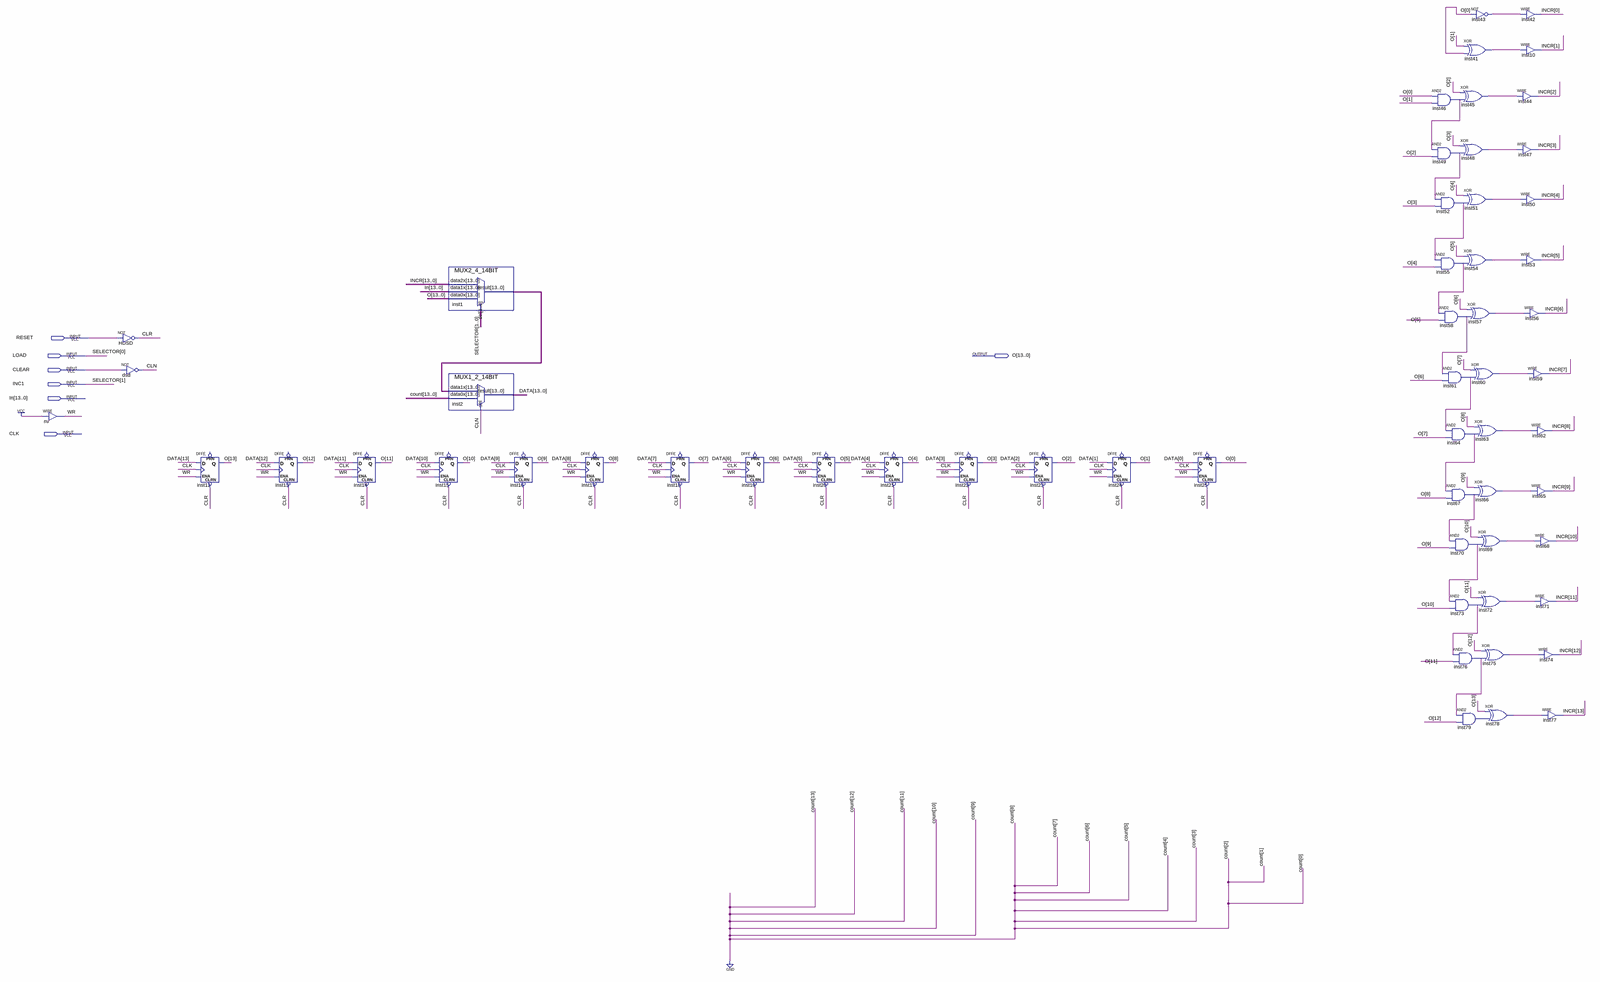
[diagram p0: schematic sheet, whole]
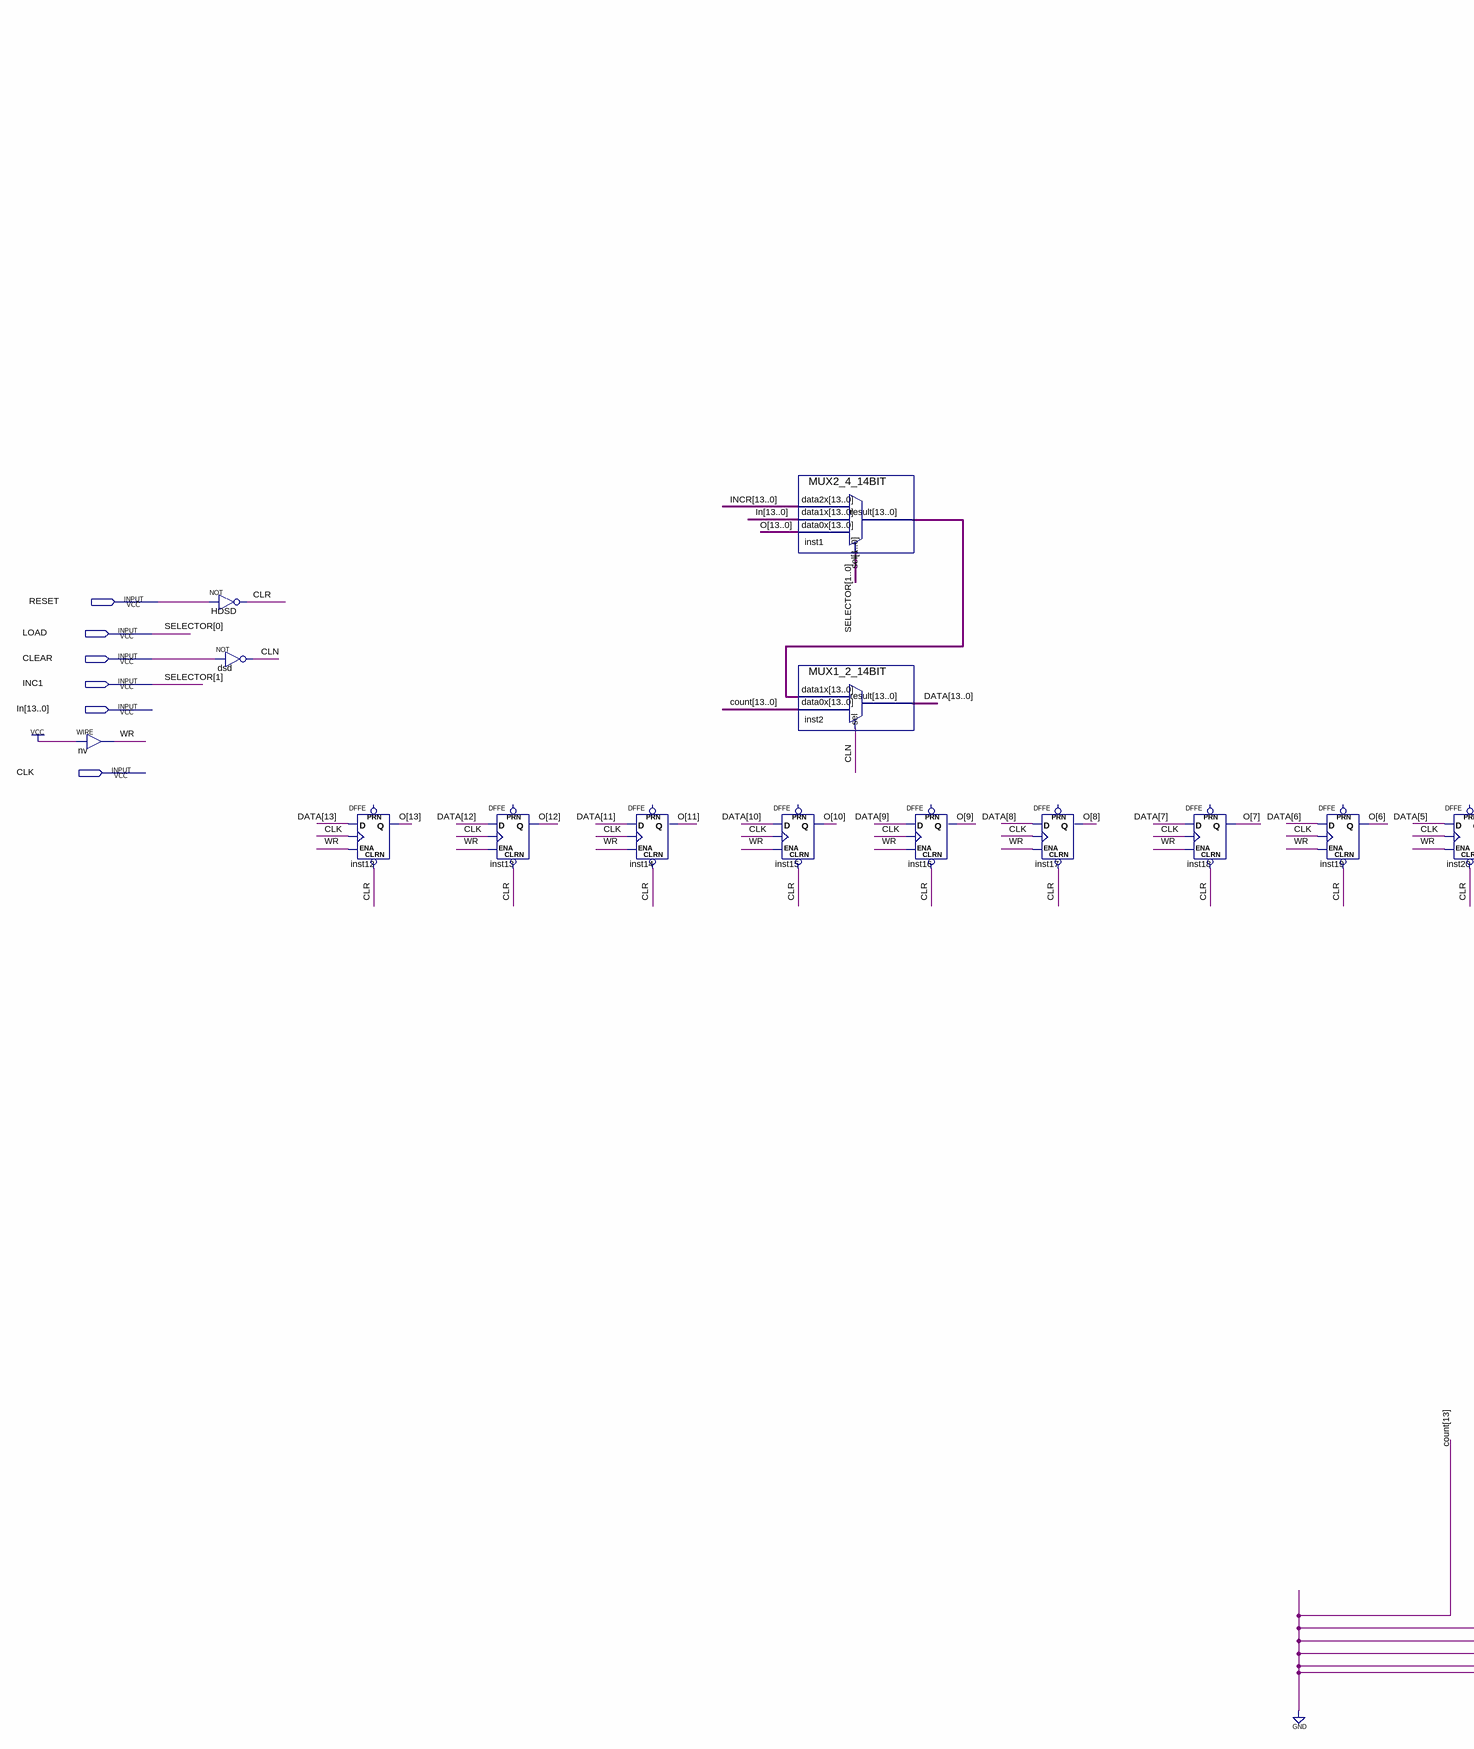
[diagram p1: schematic sheet, left part]
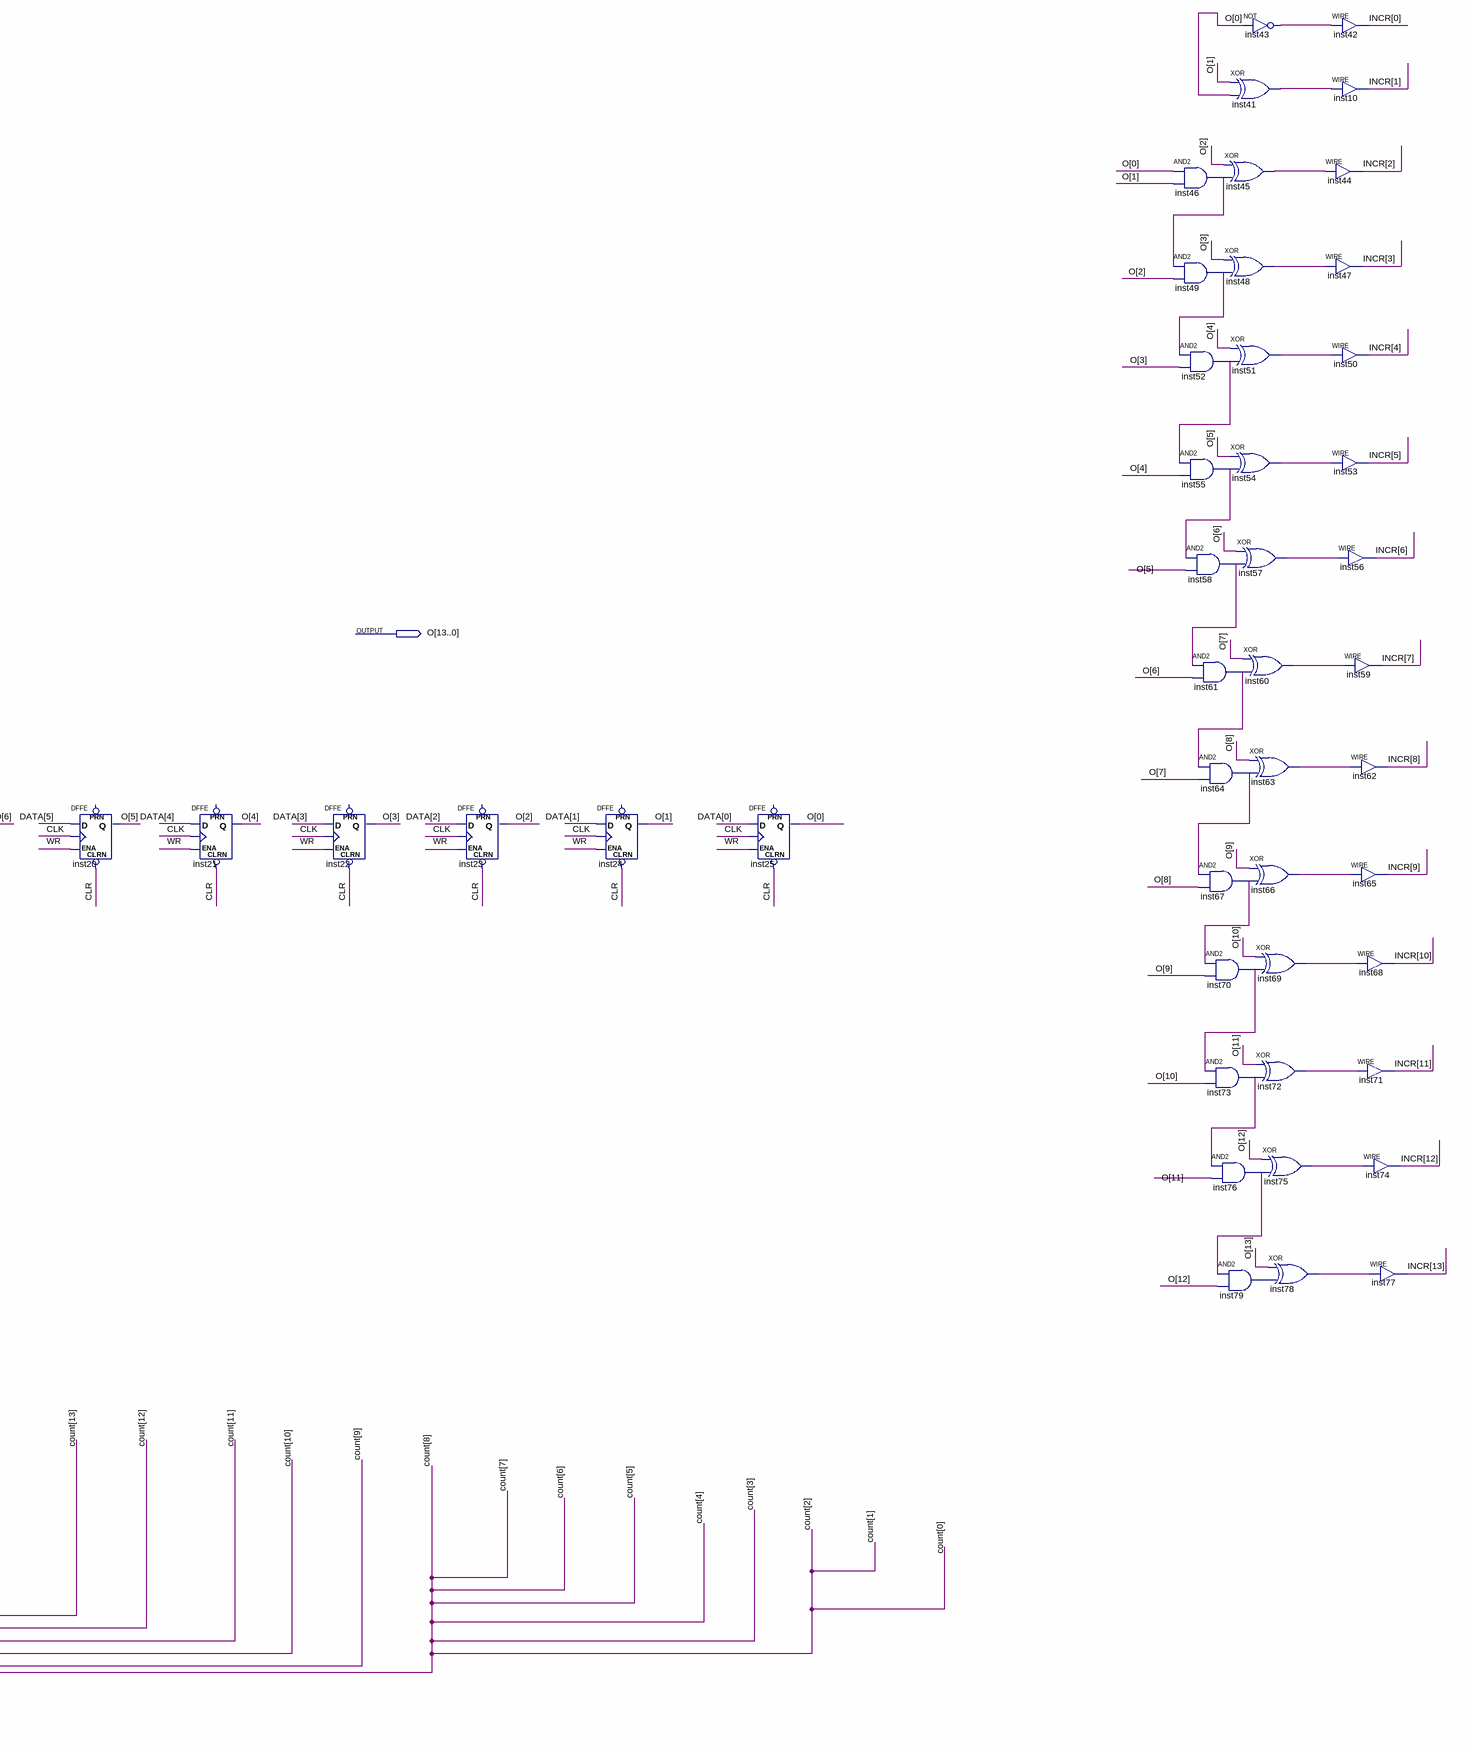
[diagram p2: schematic sheet, right part]
// Quartus schematic REG_14BIT.bdf as structural Verilog: 59 symbols, 7 pins
module REG_14BIT (
  input  RESET,
  input  LOAD,
  input  CLEAR,
  input  INC1,
  input  [13:0] In,
  input  CLK,
  output [13:0] O
);

  wire CLN, CLR, inst41_out, inst43_out, inst45_out, inst46_out, inst48_out, inst49_out, inst51_out,
       inst52_out, inst54_out, inst55_out, inst57_out, inst58_out, inst60_out, inst61_out, inst63_out,
       inst64_out, inst66_out, inst67_out, inst69_out, inst70_out, inst72_out, inst73_out, inst75_out,
       inst76_out, inst78_out, inst79_out, WR;
  wire [13:0] DATA, INCR, inst1_result;

  assign WR = 1'b1;  // WIRE nv
  not HDSD (CLR, RESET);
  not dsd (CLN, CLEAR);
  DFFE inst12 (.CLRN(CLR), .D(DATA[13]), .CLK(CLK), .ENA(WR), .Q(O[13]));  // open: PRN
  DFFE inst13 (.CLRN(CLR), .D(DATA[12]), .CLK(CLK), .ENA(WR), .Q(O[12]));  // open: PRN
  DFFE inst14 (.CLRN(CLR), .D(DATA[11]), .CLK(CLK), .ENA(WR), .Q(O[11]));  // open: PRN
  DFFE inst15 (.CLRN(CLR), .D(DATA[10]), .CLK(CLK), .ENA(WR), .Q(O[10]));  // open: PRN
  MUX2_4_14BIT inst1 (.data2x(INCR), .data1x(In), .data0x(O), .sel({INC1, LOAD}), .result(inst1_result));
  MUX1_2_14BIT inst2 (.data1x(inst1_result), .data0x({14{1'b0}}), .sel(CLN), .result(DATA));
  DFFE inst16 (.CLRN(CLR), .D(DATA[9]), .CLK(CLK), .ENA(WR), .Q(O[9]));  // open: PRN
  DFFE inst17 (.CLRN(CLR), .D(DATA[8]), .CLK(CLK), .ENA(WR), .Q(O[8]));  // open: PRN
  DFFE inst18 (.CLRN(CLR), .D(DATA[7]), .CLK(CLK), .ENA(WR), .Q(O[7]));  // open: PRN
  DFFE inst19 (.CLRN(CLR), .D(DATA[6]), .CLK(CLK), .ENA(WR), .Q(O[6]));  // open: PRN
  DFFE inst20 (.CLRN(CLR), .D(DATA[5]), .CLK(CLK), .ENA(WR), .Q(O[5]));  // open: PRN
  DFFE inst21 (.CLRN(CLR), .D(DATA[4]), .CLK(CLK), .ENA(WR), .Q(O[4]));  // open: PRN
  DFFE inst22 (.CLRN(CLR), .D(DATA[3]), .CLK(CLK), .ENA(WR), .Q(O[3]));  // open: PRN
  DFFE inst23 (.CLRN(CLR), .D(DATA[2]), .CLK(CLK), .ENA(WR), .Q(O[2]));  // open: PRN
  DFFE inst24 (.CLRN(CLR), .D(DATA[1]), .CLK(CLK), .ENA(WR), .Q(O[1]));  // open: PRN
  DFFE inst25 (.CLRN(CLR), .D(DATA[0]), .CLK(CLK), .ENA(WR), .Q(O[0]));  // open: PRN
  and inst46 (inst46_out, O[0], O[1]);
  and inst49 (inst49_out, inst46_out, O[2]);
  and inst52 (inst52_out, inst49_out, O[3]);
  and inst55 (inst55_out, inst52_out, O[4]);
  and inst58 (inst58_out, inst55_out, O[5]);
  xor inst41 (inst41_out, O[1], O[0]);
  xor inst45 (inst45_out, O[2], inst46_out);
  xor inst48 (inst48_out, O[3], inst49_out);
  xor inst51 (inst51_out, O[4], inst52_out);
  xor inst54 (inst54_out, O[5], inst55_out);
  xor inst57 (inst57_out, O[6], inst58_out);
  and inst61 (inst61_out, inst58_out, O[6]);
  and inst64 (inst64_out, inst61_out, O[7]);
  and inst67 (inst67_out, inst64_out, O[8]);
  and inst70 (inst70_out, inst67_out, O[9]);
  and inst73 (inst73_out, inst70_out, O[10]);
  and inst76 (inst76_out, inst73_out, O[11]);
  and inst79 (inst79_out, inst76_out, O[12]);
  not inst43 (inst43_out, O[0]);
  xor inst60 (inst60_out, O[7], inst61_out);
  xor inst63 (inst63_out, O[8], inst64_out);
  xor inst66 (inst66_out, O[9], inst67_out);
  xor inst69 (inst69_out, O[10], inst70_out);
  xor inst72 (inst72_out, O[11], inst73_out);
  xor inst75 (inst75_out, O[12], inst76_out);
  xor inst78 (inst78_out, O[13], inst79_out);
  assign INCR[0] = inst43_out;  // WIRE inst42
  assign INCR[1] = inst41_out;  // WIRE inst10
  assign INCR[2] = inst45_out;  // WIRE inst44
  assign INCR[3] = inst48_out;  // WIRE inst47
  assign INCR[4] = inst51_out;  // WIRE inst50
  assign INCR[5] = inst54_out;  // WIRE inst53
  assign INCR[6] = inst57_out;  // WIRE inst56
  assign INCR[7] = inst60_out;  // WIRE inst59
  assign INCR[8] = inst63_out;  // WIRE inst62
  assign INCR[9] = inst66_out;  // WIRE inst65
  assign INCR[10] = inst69_out;  // WIRE inst68
  assign INCR[11] = inst72_out;  // WIRE inst71
  assign INCR[12] = inst75_out;  // WIRE inst74
  assign INCR[13] = inst78_out;  // WIRE inst77

  // Other names for the same wires on the sheet: SELECTOR[1:0] = {INC1, LOAD}
endmodule
